# EasyEDA Pro project ESP32_S3_simpleFOC.eprj

# Schematic simpleFOC

## Sheets
1 MCU_P0: Board Name: Board1; Create Date: 2025-11-21; Page Name: MCU_P0; Project Name: ESP32_S3_simpleFOC; Schematic Name: simpleFOC; Update Date: 2025-11-28; Company: 嘉立创EDA; Page Size: A4; Version: V1.0
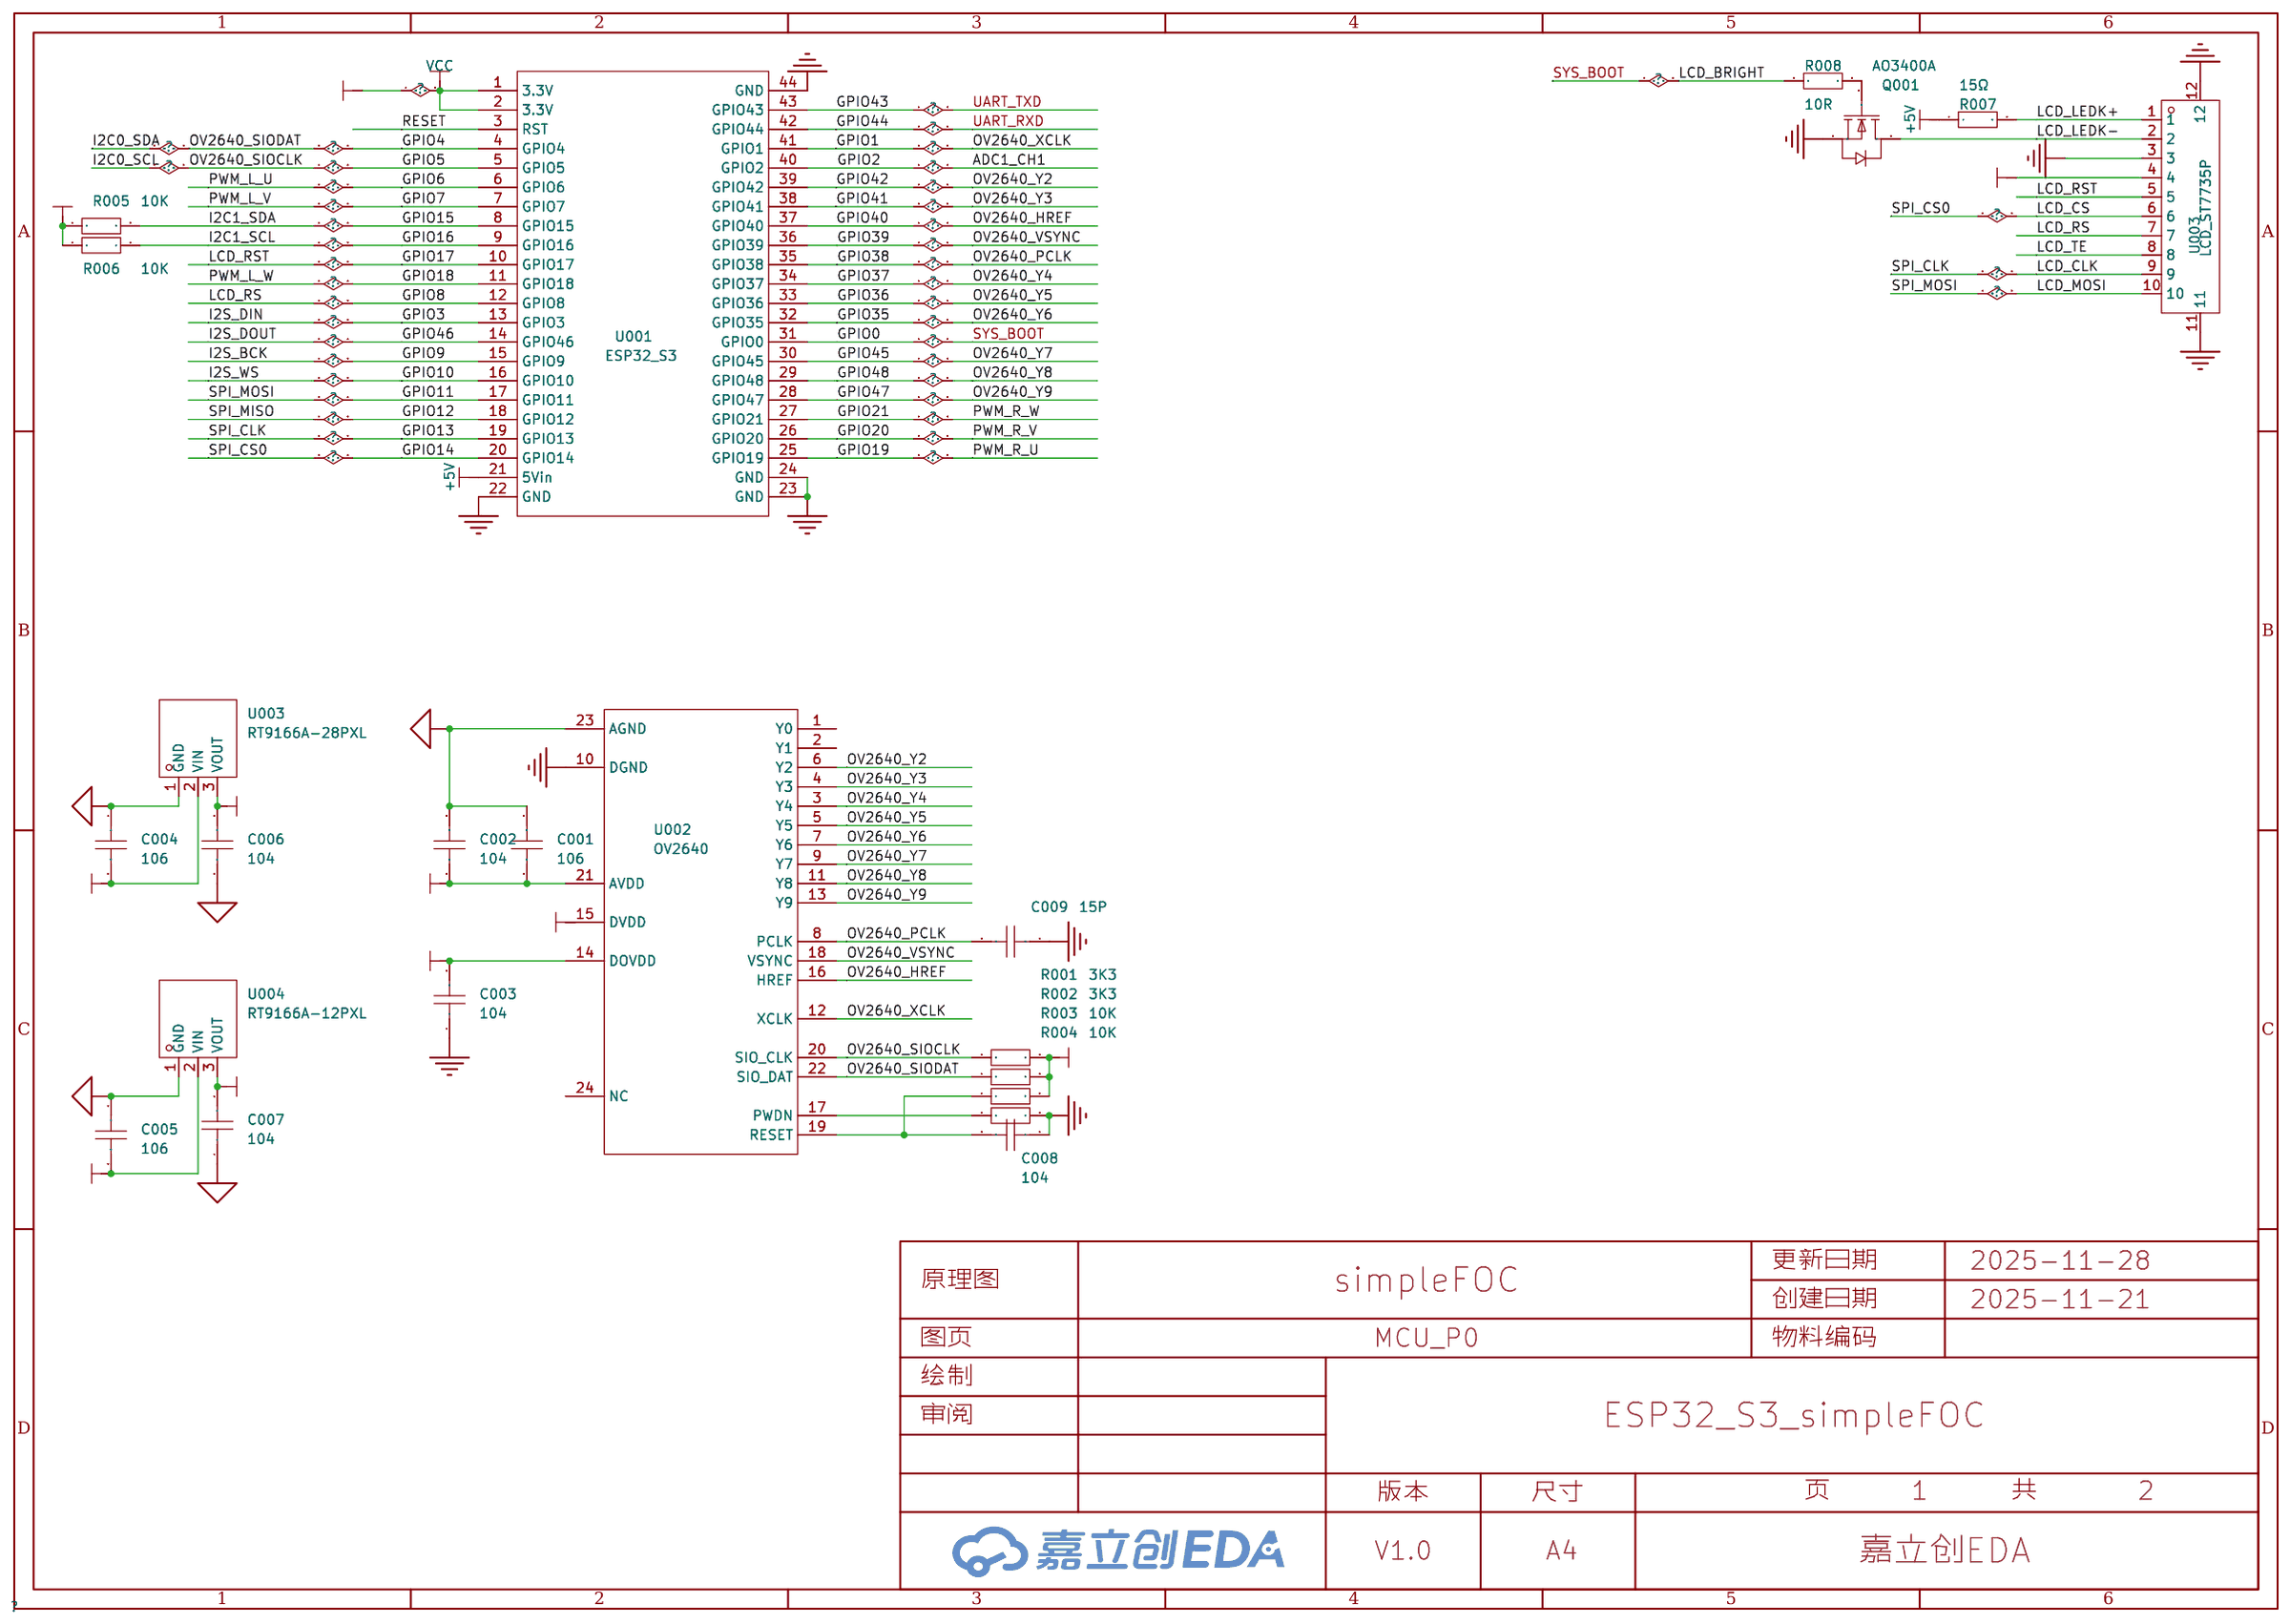
[diagram p0: MCU_P0]
2 BLDC_P1: Page Name: BLDC_P1; Update Date: 2025-11-21
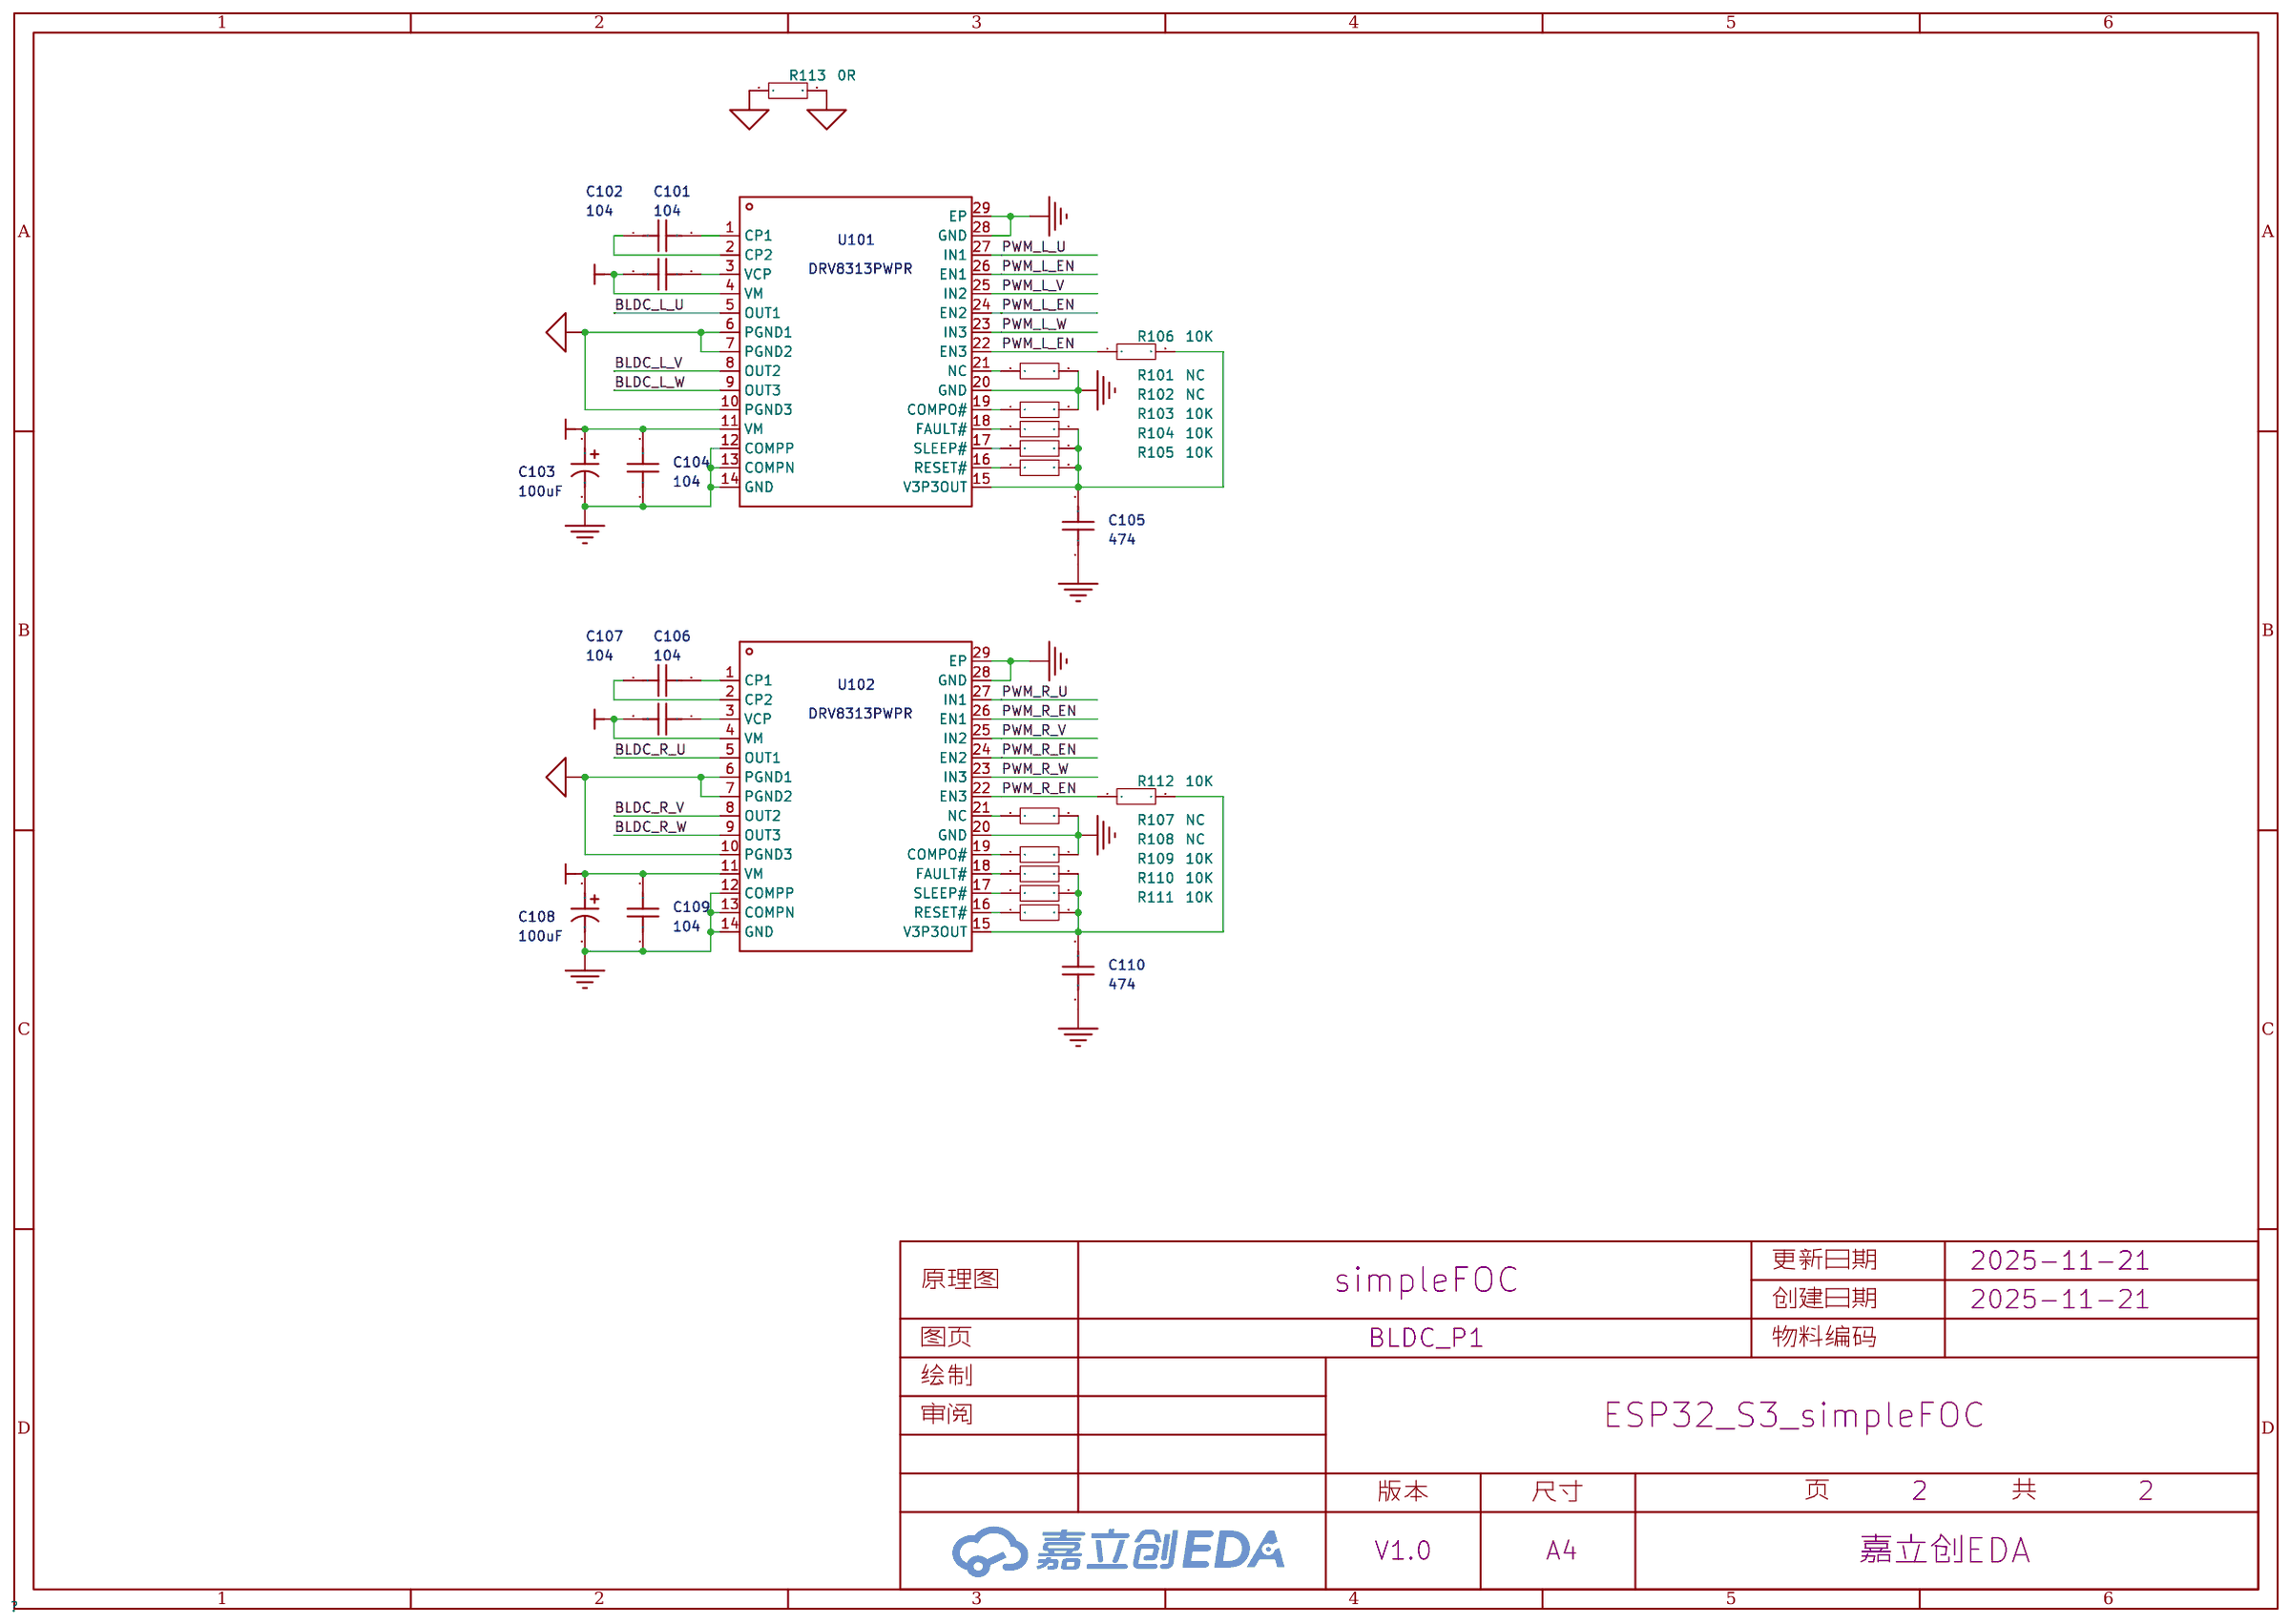
[diagram p1: BLDC_P1]

## Parts
sheet BLDC_P1
C101  104  [C0603]
C102  104  [C0603]
C103  100uF  [CAP-SMD_BD6.3-L6.6-W6.6-RD]
C104  104  [C0603]
C105  474  [C0603]
C106  104  [C0603]
C107  104  [C0603]
C108  100uF  [CAP-SMD_BD6.3-L6.6-W6.6-RD]
C109  104  [C0603]
C110  474  [C0603]
R101  10K  [R0603]
R102  10K  [R0603]
R103  10K  [R0603]
R104  10K  [R0603]
R105  10K  [R0603]
R106  10K  [R0603]
R107  10K  [R0603]
R108  10K  [R0603]
R109  10K  [R0603]
R110  10K  [R0603]
R111  10K  [R0603]
R112  10K  [R0603]
R113  0R  [R0603]
U101  DRV8313PWPR  [HTSSOP-28_L9.8-W4.5-P0.65-LS6.6-BL-EP]
U102  DRV8313PWPR  [HTSSOP-28_L9.8-W4.5-P0.65-LS6.6-BL-EP]
sheet MCU_P0
C001  100nF  [C0805]
C002  100nF  [C0603]
C003  100nF  [C0603]
C004  100nF  [C0805]
C005  100nF  [C0805]
C006  100nF  [C0603]
C007  100nF  [C0603]
C008  100nF  [C0603]
C009  100nF  [C0603]
Q001  AO3400A  [SOT-23-3_L2.9-W1.3-P1.90-LS2.4-BR]
R001  10K  [R0603]
R002  10K  [R0603]
R003  10K  [R0603]
R004  10K  [R0603]
R005  10K  [R0603]
R006  10K  [R0603]
R007  15Ω  [R0805]
R008  10K  [R0603]
U001  ESP32_S3  [ESP32_S3_N16R8]
U002  OV2640  [FPC-SMD_24P-P0.50_FPC-05F-24PH20]
U003  RT9166A-28PXL  [SOT-89-3_L4.5-W2.5-P1.50-LS4.2-BR]
U003#2  LCD_ST7735P  [FPC-SMD_10P-P1.00_XYECONN_FPC10-S1.0-10AH2.5]
U004  RT9166A-12PXL  [SOT-89-3_L4.5-W2.5-P1.50-LS4.2-BR]

## Library data of the parts
C101 C106 = 0603B103K500NT: LCSC Part Name: 10nF ±10% 50V; Supplier Part: C57112; Manufacturer: FH(风华); Supplier Footprint: 0603; JLCPCB Part Class: Basic Part; Datasheet: https://item.szlcsc.com/datasheet/0603B103K500NT/58143.html; Supplier: LCSC; Tolerance: ±10%; Voltage Rating: 50V; Temperature Coefficient: X7R
C102 C104 C105 C107 C109 C110 = CGA0603X7R104K500JT: LCSC Part Name: 100nF ±10% 50V; Supplier Part: C6119867; Manufacturer: HRE(芯声); Supplier Footprint: 0603; JLCPCB Part Class: Extended Part; Datasheet: https://atta.szlcsc.com/upload/public/pdf/source/20250103/C44077DA9E7B3EFAE02F22B6D3D1CBC9.pdf; Supplier: LCSC; Tolerance: ±10%; Voltage Rating: 50V; Temperature Coefficient: X7R
C103 C108 = MA35V100M6X8: LCSC Part Name: 100uF ±20% 35V; Supplier Part: C46550467; Manufacturer: 捷而瑞; Supplier Footprint: SMD,D6.3xL7.7mm; JLCPCB Part Class: 扩展库; Datasheet: https://item.szlcsc.com/datasheet/MA35V100M6X8/48680161.html; Supplier: LCSC; Tolerance: ±20%; Voltage Rating: 35V; Ripple Current: 2.9A@100kHz; Equivalent Series Resistance(ESR): 30mΩ@100kHz; Type: 聚合物; Diameter: 6.3mm; Height - Seated (Max): 7mm; Lifetime: 2000hrs@105℃; Operating Temperature: -55℃~+105℃
R001 R002 R003 R004 R005 R006 R008 R101-R113 = Res_0603: Supplier Footprint: 0603
U101 U102 = DRV8313PWPR: LCSC Part Name: 无刷直流BLDC电机驱动芯片 60V; Supplier Part: C92482; Manufacturer: TI(德州仪器); Supplier Footprint: HTSSOP-28; JLCPCB Part Class: 扩展库; Datasheet: https://www.ti.com/cn/lit/gpn/drv8313; Supplier: LCSC; Drive Type: 三相; Integrated FETs: 是; Number of Half Bridges: 3; Peak Current: 2.5A; Quiescent Current(Iq): 800uA; Operating Temperature: -40℃~+125℃
C001 C002 C003 C004 C005 C006 C007 C008 C009 = CAP_0603: Supplier Footprint: 0603
Q001 = AO3400A_C20917: LCSC Part Name: 1个N沟道 耐压:30V 电流:5.7A; Supplier Part: C20917; Manufacturer: AOS; Supplier Footprint: SOT-23-3L; JLCPCB Part Class: 基础库; Datasheet: https://item.szlcsc.com/datasheet/AO3400A/21629.html; Supplier: LCSC; Drain to Source Voltage: 30V; RDS(on): 48mΩ@2.5V; Gate Threshold Voltage (Vgs(th)): 1.45V@250uA; Gate Charge(Qg): 7nC@10V; Input Capacitance(Ciss): 630pF@15V; Operating Temperature: -55℃~+150℃@(Tj); Type: N沟道
R007 = FRC0805F15R0TS: LCSC Part Name: 15Ω ±1% 125mW 厚膜电阻; Supplier Part: C2907229; Manufacturer: FOJAN(富捷); Supplier Footprint: 0805; JLCPCB Part Class: Extended Part; Datasheet: https://item.szlcsc.com/datasheet/FRC0805F15R0TS/3180742.html; Supplier: LCSC; Type: 厚膜电阻; Tolerance: ±1%; Power(Watts): 125mW; Voltage-Supply(Max): 150V; Temperature Coefficient: ±100ppm/℃; Operating Temperature: -55℃~+155℃
U001 = ESP32_S3_N16R8
U002 = ov2640
U003 U004 = RT9166A-25GXL: LCSC Part Name: 输入5.5V 输出2.5V 600mA; Supplier Part: C114480; Manufacturer: RICHTEK(立锜); Supplier Footprint: SOT-89-3; JLCPCB Part Class: 扩展库; Datasheet: https://atta.szlcsc.com/upload/public/pdf/source/20170918/C130829_1505703424314975354.pdf; Supplier: LCSC; Output Type: 固定; Voltage - Supply: 5.5V; Output Current: 600mA; Power Supply Rejection Ratio (PSRR): 55dB; Voltage Dropout: 580mV@(600mA); standby current: 220uA; Features: 过流保护；短路保护；过热保护; Operating Temperature: -40℃~+125℃@(Tj); Output Configuration: 正极
U003#2 = FPC10-S1.0-10AH2.5: LCSC Part Name: 间距:1mm P数:10P 抽屉式 上接; Supplier Part: C19269874; Manufacturer: XYECONN(辛译); Supplier Footprint: SMD,P=1mm,卧贴; JLCPCB Part Class: 扩展库; Datasheet: https://item.szlcsc.com/datasheet/FPC10-S1.0-10AH2.5/20533493.html; Supplier: LCSC; Locking Feature: 抽屉式; Contact Type: 上接; Number of Contacts: 10P; Pitch: 1mm; Mounting Type: 卧贴; Height Above Board: 2.5mm

## Nets
+1V2: C007.2 U002.15(DVDD) U004.3(VOUT)
+2V8: C001.1 C002.1 C006.2 U002.21(AVDD) U003.3(VOUT)
+3V3: C003.2 C004.2 C005.2 R001.2 R002.2 R003.2 R005.1 R006.1 U001.1(3.3V) U001.2(3.3V) U002.14(DOVDD) U003.2(VIN) U003#2.4 U004.2(VIN)
+5V: R007.1 U001.21(5Vin)
AGND: C001.2 C002.2 C004.1 C005.1 C006.1 C007.1 R113.1 R113.2 U002.23(AGND) U003.1(GND) U004.1(GND) U101.6(PGND1) U101.7(PGND2) U101.10(PGND3) U102.6(PGND1) U102.7(PGND2) U102.10(PGND3)
GND: C003.1 C008.1 C009.1 C103.2 C104.1 C105.1 C108.2 C109.1 C110.1 Q001.2(S) R004.2 R101.2 R102.2 R107.2 R108.2 U001.22(GND) U001.23(GND) U001.24(GND) U001.44(GND) U002.10(DGND) U003#2.3 U003#2.11 U003#2.12 U101.12(COMPP) U101.13(COMPN) U101.14(GND) U101.20(GND) U101.28(GND) U101.29(EP) U102.12(COMPP) U102.13(COMPN) U102.14(GND) U102.20(GND) U102.28(GND) U102.29(EP)
ADC1_CH1: U001.40(GPIO2)
BAT+: C102.2 C103.1 C104.2 C107.2 C108.1 C109.2 U101.4(VM) U101.11(VM) U102.4(VM) U102.11(VM)
BLDC_L_U: U101.5(OUT1)
BLDC_L_V: U101.8(OUT2)
BLDC_L_W: U101.9(OUT3)
BLDC_R_U: U102.5(OUT1)
BLDC_R_V: U102.8(OUT2)
BLDC_R_W: U102.9(OUT3)
GPIO0: R008.1 U001.31(GPIO0)
GPIO1: U001.41(GPIO1) U002.12(XCLK)
GPIO3: U001.13(GPIO3)
GPIO4: R002.1 U001.4(GPIO4) U002.22(SIO_DAT)
GPIO5: R001.1 U001.5(GPIO5) U002.20(SIO_CLK)
GPIO6: U001.6(GPIO6) U101.27(IN1)
GPIO7: U001.7(GPIO7) U101.25(IN2)
GPIO8: U001.12(GPIO8) U003#2.7
GPIO9: U001.15(GPIO9)
GPIO10: U001.16(GPIO10)
GPIO11: U001.17(GPIO11) U003#2.10
GPIO12: U001.18(GPIO12)
GPIO13: U001.19(GPIO13) U003#2.9
GPIO14: U001.20(GPIO14) U003#2.6
GPIO15: R005.2 U001.8(GPIO15)
GPIO16: R006.2 U001.9(GPIO16)
GPIO17: U001.10(GPIO17) U003#2.5
GPIO18: U001.11(GPIO18) U101.23(IN3)
GPIO19: U001.25(GPIO19) U102.27(IN1)
GPIO20: U001.26(GPIO20) U102.25(IN2)
GPIO21: U001.27(GPIO21) U102.23(IN3)
GPIO35: U001.32(GPIO35) U002.7(Y6)
GPIO36: U001.33(GPIO36) U002.5(Y5)
GPIO37: U001.34(GPIO37) U002.3(Y4)
GPIO38: C009.2 U001.35(GPIO38) U002.8(PCLK)
GPIO39: U001.36(GPIO39) U002.18(VSYNC)
GPIO40: U001.37(GPIO40) U002.16(HREF)
GPIO41: U001.38(GPIO41) U002.4(Y3)
GPIO42: U001.39(GPIO42) U002.6(Y2)
GPIO43: U001.43(GPIO43)
GPIO44: U001.42(GPIO44)
GPIO45: U001.30(GPIO45) U002.9(Y7)
GPIO46: U001.14(GPIO46)
GPIO47: U001.28(GPIO47) U002.13(Y9)
GPIO48: U001.29(GPIO48) U002.11(Y8)
LCD_LEDK+: R007.2 U003#2.1
LCD_LEDK-: Q001.3(D) U003#2.2
LCD_TE: U003#2.8
PWM_L_EN: R106.1 U101.22(EN3) U101.24(EN2) U101.26(EN1)
PWM_R_EN: R112.1 U102.22(EN3) U102.24(EN2) U102.26(EN1)
RESET: U001.3(RST)
$4N6826: C101.2 U101.1(CP1)
$4N6827: C101.1 U101.2(CP2)
$4N6828: C102.1 U101.3(VCP)
$4N7191: R101.1 U101.21(NC)
$4N7202: R102.1 U101.19(COMPO#)
$4N7437: R105.1 U101.16(RESET#)
$4N7471: R103.1 U101.18(FAULT#)
$4N7475: R104.1 U101.17(SLEEP#)
$4N8152: R111.1 U102.16(RESET#)
$4N8157: R110.1 U102.17(SLEEP#)
$4N8159: R109.1 U102.18(FAULT#)
$4N8161: R108.1 U102.19(COMPO#)
$4N8167: R107.1 U102.21(NC)
$4N8169: C106.1 U102.2(CP2)
$4N8179: C107.1 U102.3(VCP)
$4N8181: C106.2 U102.1(CP1)
Net-(C008-2): C008.2 R003.1 U002.19(RESET)
Net-(C105-2): C105.2 R103.2 R104.2 R105.2 R106.2 U101.15(V3P3OUT)
Net-(C110-2): C110.2 R109.2 R110.2 R111.2 R112.2 U102.15(V3P3OUT)
Net-(Q001-1): Q001.1(G) R008.2
Net-(R004-1): R004.1 U002.17(PWDN)

Not connected (* = marked no-connect by the designer): U002 1(Y0) 2(Y1) 24(NC)

# Board PCB1
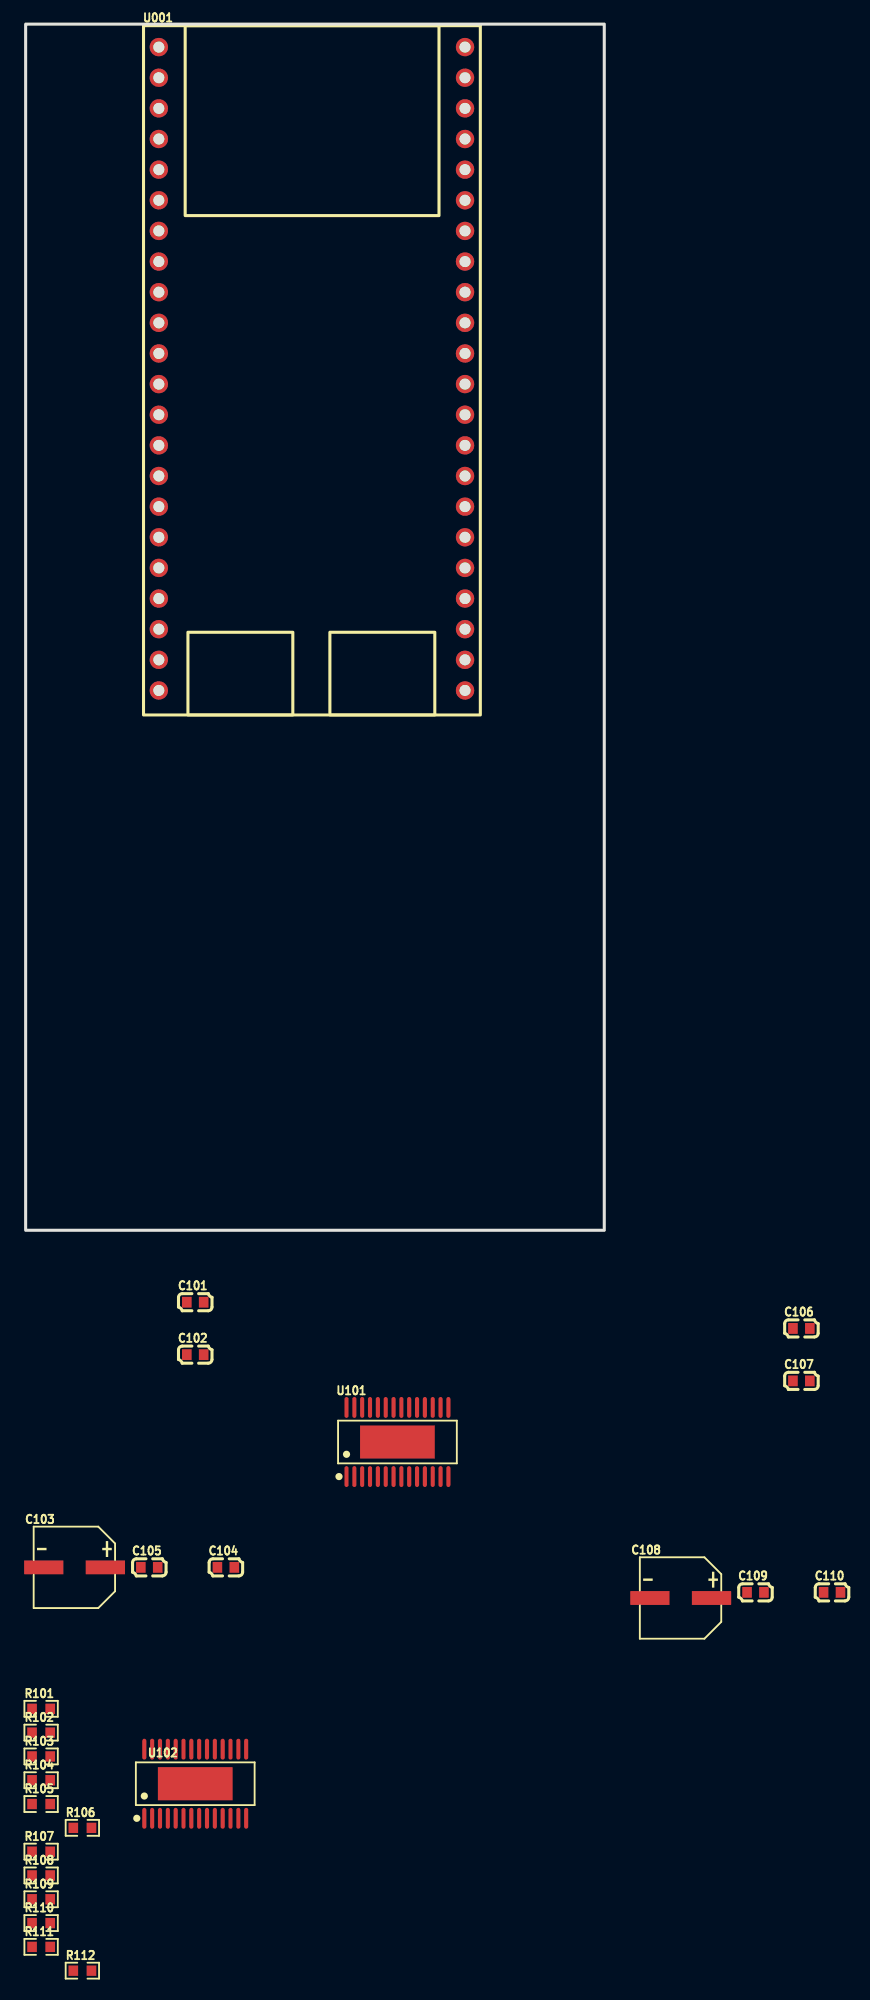
[diagram p2: board, top side]
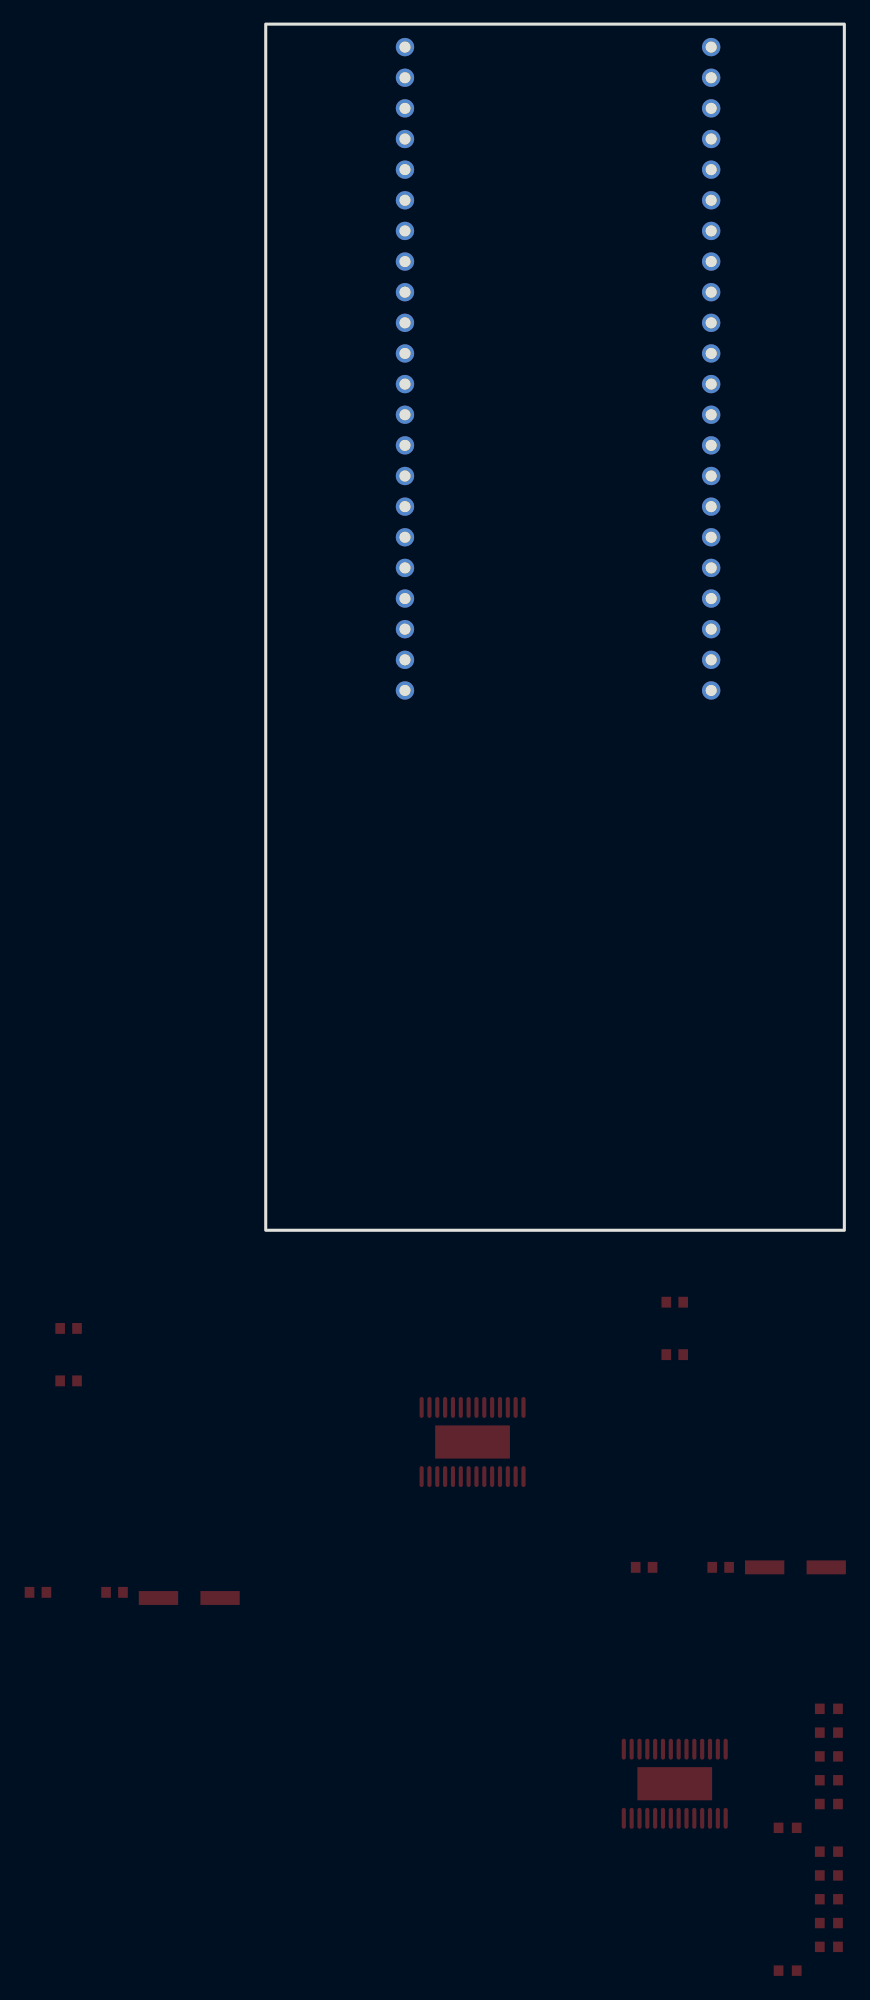
[diagram p3: board, bottom side, seen from below]

Outline 48 x 100 mm; copper layers: Top Layer, Bottom Layer. Coordinates in mm from the lower left corner of the outline.
Outline path: rectangle 0,100 48,0
Stack: Top Layer 0.035mm / Dielectric1 1.51mm FR4 er 4.5 / Bottom Layer 0.035mm

## Design rules (mm)
template: JLCPCB Capability(Two Layers Board)
spacing copperThickness1oz (default): track to track 0.102, other pairs 0.152 to 0.3
spacing copperThickness2oz: track to track 0.203, other pairs 0.152 to 0.3
track width copperThickness1oz (default): min 0.127, default 0.254, max 2.54
track width copperThickness2oz: min 0.203, default 0.254, max 2.54
differential pair differentialPair (default): width min 0.127, default 0.254, max 2.54; gap min 0.152, default 0.152
via viaSize (default): diameter min 0.5, default 0.61, max 10; hole min 0.3, default 0.305, max 6.3

## Placement (name value [footprint] x y rotation side)
C101  104  [C0603]  14.07 -5.96 0 top
C102  104  [C0603]  14.07 -10.31 0 top
C103  100uF  [CAP-SMD_BD6.3-L6.6-W6.6-RD]  4.06 -27.95 0 top
C104  104  [C0603]  16.61 -27.95 0 top
C105  474  [C0603]  10.26 -27.95 0 top
C106  104  [C0603]  64.35 -8.14 0 top
C107  104  [C0603]  64.35 -12.49 0 top
C108  100uF  [CAP-SMD_BD6.3-L6.6-W6.6-RD]  54.34 -30.49 0 top
C109  104  [C0603]  60.54 -30.02 0 top
C110  474  [C0603]  66.89 -30.02 0 top
R101  10K  [R0603]  1.28 -39.68 0 top
R102  10K  [R0603]  1.28 -41.65 0 top
R103  10K  [R0603]  1.28 -43.62 0 top
R104  10K  [R0603]  1.28 -45.6 0 top
R105  10K  [R0603]  1.28 -47.57 0 top
R106  10K  [R0603]  4.71 -49.54 0 top
R107  10K  [R0603]  1.28 -51.52 0 top
R108  10K  [R0603]  1.28 -53.49 0 top
R109  10K  [R0603]  1.28 -55.47 0 top
R110  10K  [R0603]  1.28 -57.44 0 top
R111  10K  [R0603]  1.28 -59.41 0 top
R112  10K  [R0603]  4.71 -61.39 0 top
U001  ESP32_S3  [ESP32_S3_N16R8]  11.05 98.09 0 top
U101  DRV8313PWPR  [HTSSOP-28_L9.8-W4.5-P0.65-LS6.6-BL-EP]  30.84 -17.56 0 top
U102  DRV8313PWPR  [HTSSOP-28_L9.8-W4.5-P0.65-LS6.6-BL-EP]  14.07 -45.89 0 top

## Footprints (pads in the part's own frame, mm; a bottom-side part is the same pattern mirrored in y, then rotated)
C0603
  rect 0.8x0.9 smd: 1(-0.7,0) 2(0.7,0)
CAP-SMD_BD6.3-L6.6-W6.6-RD
  rect 3.26x1.15 smd: 1(2.555,0) 2(-2.555,0)
ESP32_S3_N16R8
  round 1.524 hole 0.914: 1(0,0) 2(0,-2.54) 3(0,-5.08) 4(0,-7.62) 5(0,-10.16) 6(0,-12.7) 7(0,-15.24) 8(0,-17.78) 9(0,-20.32) 10(0,-22.86) 11(0,-25.4) 12(0,-27.94) 13(0,-30.48) 14(0,-33.02) 15(0,-35.56) 16(0,-38.1) 17(0,-40.64) 18(0,-43.18) 19(0,-45.72) 20(0,-48.26) 21(0,-50.8) 22(0,-53.34) 23(25.4,-53.34) 24(25.4,-50.8) 25(25.4,-48.26) 26(25.4,-45.72) 27(25.4,-43.18) 28(25.4,-40.64) 29(25.4,-38.1) 30(25.4,-35.56) 31(25.4,-33.02) 32(25.4,-30.48) 33(25.4,-27.94) 34(25.4,-25.4) 35(25.4,-22.86) 36(25.4,-20.32) 37(25.4,-17.78) 38(25.4,-15.24) 39(25.4,-12.7) 40(25.4,-10.16) 41(25.4,-7.62) 42(25.4,-5.08) 43(25.4,-2.54) 44(25.4,0)
HTSSOP-28_L9.8-W4.5-P0.65-LS6.6-BL-EP
  oval 0.343x1.732 smd: 1(-4.225,-2.866) 2(-3.575,-2.866) 3(-2.925,-2.866) 4(-2.275,-2.866) 5(-1.625,-2.866) 6(-0.975,-2.866) 7(-0.325,-2.866) 8(0.325,-2.866) 9(0.975,-2.866) 10(1.625,-2.866) 11(2.275,-2.866) 12(2.925,-2.866) 13(3.575,-2.866) 14(4.225,-2.866) 15(4.225,2.866) 16(3.575,2.866) 17(2.925,2.866) 18(2.275,2.866) 19(1.625,2.866) 20(0.975,2.866) 21(0.325,2.866) 22(-0.325,2.866) 23(-0.975,2.866) 24(-1.625,2.866) 25(-2.275,2.866) 26(-2.925,2.866) 27(-3.575,2.866) 28(-4.225,2.866)
  rect 6.2x2.75 smd: 29(0,0)
R0603
  rect 0.806x0.864 smd: 1(-0.753,0) 2(0.753,0)

## Nets
AGND: U101.6 U101.7 U101.10 U102.6 U102.7 U102.10
GND: C103.2 C104.1 C105.1 C108.2 C109.1 C110.1 R101.2 R102.2 R107.2 R108.2 U101.12 U101.13 U101.14 U101.20 U101.28 U101.29 U102.12 U102.13 U102.14 U102.20 U102.28 U102.29
VCC: U001.1 U001.2
BAT+: C102.2 C103.1 C104.2 C107.2 C108.1 C109.2 U101.4 U101.11 U102.4 U102.11
BLDC_L_U: U101.5 U102.5
BLDC_L_V: U101.8 U102.8
BLDC_L_W: U101.9 U102.9
PWM_L_EN: R106.2 R112.2 U101.22 U101.24 U101.26 U102.22 U102.24 U102.26
PWM_L_U: U101.27 U102.27
PWM_L_V: U101.25 U102.25
PWM_L_W: U101.23 U102.23
RESET: U001.3
$4N6826: C101.2 U101.1
$4N6827: C101.1 U101.2
$4N6828: C102.1 U101.3
$4N7191: R101.1 U101.21
$4N7202: R102.1 U101.19
$4N7437: R105.1 U101.16
$4N7471: R103.1 U101.18
$4N7475: R104.1 U101.17
$4N7480: C105.2 R103.2 R104.2 R105.2 R106.1 U101.15
$4N8147: C110.2 R109.2 R110.2 R111.2 R112.1 U102.15
$4N8152: R111.1 U102.16
$4N8157: R110.1 U102.17
$4N8159: R109.1 U102.18
$4N8161: R108.1 U102.19
$4N8167: R107.1 U102.21
$4N8169: C106.1 U102.2
$4N8179: C107.1 U102.3
$4N8181: C106.2 U102.1

Pads without a net: U001 4 5 6 7 8 9 10 11 12 13 14 15 16 17 18 19 20 21 22 23 24 25 26 27 28 29 30 31 32 33 34 35 36 37 38 39 40 41 42 43 44
